# Altium schematic sheet APC_Sensor.SchDoc
size A4; SheetNumber: 1; SheetTotal: 1
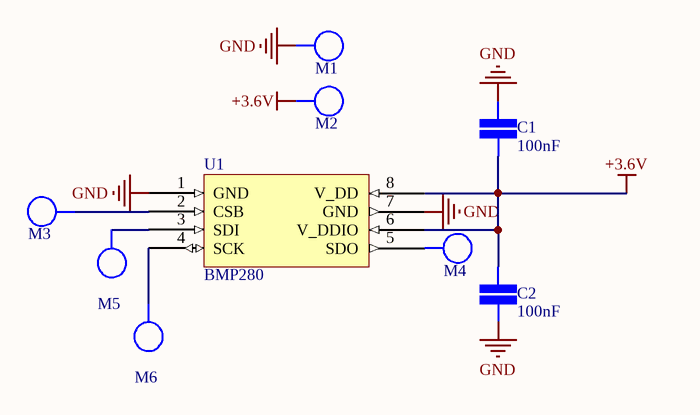
[diagram p0: APC_Sensor.SchDoc]

## Parts
C1  100nF  [CAP 0603/1608]
C2  100nF  [CAP 0603/1608]
M1  mounting pad  [MOUNTING_PAD_M4]  (value not drawn)  (no BOM)
M2  mounting pad  [MOUNTING_PAD_M4]  (value not drawn)  (no BOM)
M3  mounting pad  [MOUNTING_PAD_M4]  (value not drawn)  (no BOM)
M4  mounting pad  [MOUNTING_PAD_M4]  (value not drawn)  (no BOM)
M5  mounting pad  [MOUNTING_PAD_M4]  (value not drawn)  (no BOM)
M6  mounting pad  [MOUNTING_PAD_M4]  (value not drawn)  (no BOM)
U1  BMP280  [LGA 8 Fusch]

## Nets
+3.6V: C1.2 C2.2 M2.1 U1.6(V_DDIO) U1.8(V_DD)
GND: C1.1 C2.1 M1.1 U1.1(GND) U1.7(GND)
NetM3_1: M3.1 U1.2(CSB)
NetM4_1: M4.1 U1.5(SDO)
NetM5_1: M5.1 U1.3(SDI)
NetM6_1: M6.1 U1.4(SCK)

## Library data of the parts
C1 C2 = SMD Capacitor: Capacitor with multiple Footprints; Value: 100nF
U1 = BMP280: Absolut Pressure Sensor for APC